# EAGLE schematic Keyboard _Schematic (EAGLE 9.7.0)

## Sheet 1 of 4
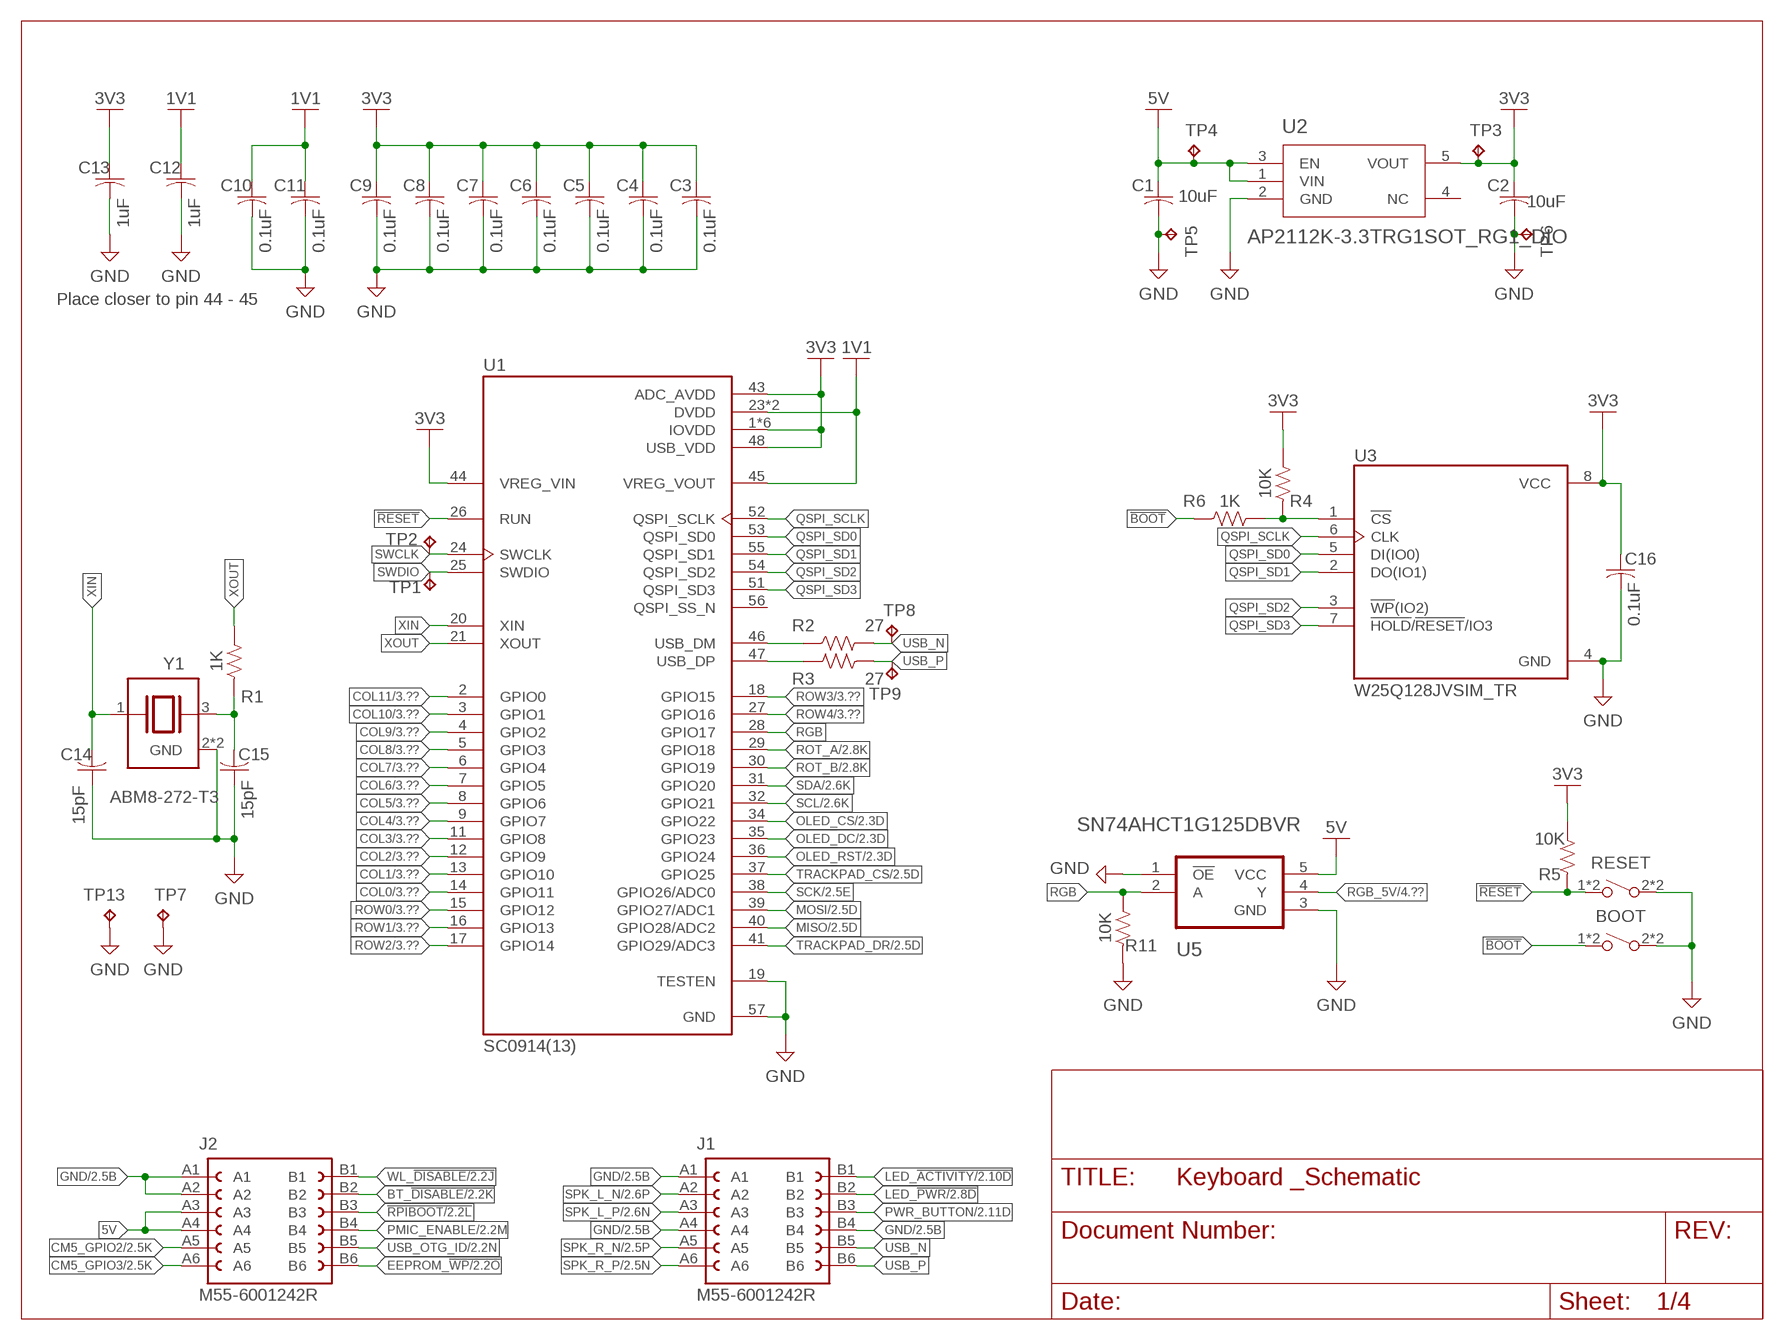
[diagram p0: schematic, sheet 1]

### Parts
BOOT  SPST-NO_SWITCH_KMR2  [KMR2]
C1  10uF  C-US_CHIP-1206(3216-METRIC)  [CAPC3216X135]
C2  10uF  C-US_CHIP-1206(3216-METRIC)  [CAPC3216X135]
C3  0.1uF  C-US_CHIP-0805(2012-METRIC)  [CAPC2012X110]
C4  0.1uF  C-US_CHIP-0805(2012-METRIC)  [CAPC2012X110]
C5  0.1uF  C-US_CHIP-0805(2012-METRIC)  [CAPC2012X110]
C6  0.1uF  C-US_CHIP-0805(2012-METRIC)  [CAPC2012X110]
C7  0.1uF  C-US_CHIP-0805(2012-METRIC)  [CAPC2012X110]
C8  0.1uF  C-US_CHIP-0805(2012-METRIC)  [CAPC2012X110]
C9  0.1uF  C-US_CHIP-0805(2012-METRIC)  [CAPC2012X110]
C10  0.1uF  C-US_CHIP-0805(2012-METRIC)  [CAPC2012X110]
C11  0.1uF  C-US_CHIP-0805(2012-METRIC)  [CAPC2012X110]
C12  1uF  C-US_CHIP-0805(2012-METRIC)  [CAPC2012X110]
C13  1uF  C-US_CHIP-0805(2012-METRIC)  [CAPC2012X110]
C14  15pF  C-US_CHIP-0805(2012-METRIC)  [CAPC2012X110]
C15  15pF  C-US_CHIP-0805(2012-METRIC)  [CAPC2012X110]
C16  0.1uF  C-US_CHIP-0805(2012-METRIC)  [CAPC2012X110]
J1  M55-6001242R  [HARWIN_M55-6001242R]
J2  M55-6001242R  [HARWIN_M55-6001242R]
R1  1K  R-US_CHIP-0805(2012-METRIC)  [RESC2012X65]
R2  27  R-US_CHIP-0805(2012-METRIC)  [RESC2012X65]
R3  27  R-US_CHIP-0805(2012-METRIC)  [RESC2012X65]
R4  10K  R-US_CHIP-0805(2012-METRIC)  [RESC2012X65]
R5  10K  R-US_CHIP-0805(2012-METRIC)  [RESC2012X65]
R6  1K  R-US_CHIP-0805(2012-METRIC)  [RESC2012X65]
R11  10K  R-US_CHIP-0805(2012-METRIC)  [RESC2012X65]
RESET  SPST-NO_SWITCH_KMR2  [KMR2]
TP1  TPB2,54  [B2,54]
TP2  TPB2,54  [B2,54]
TP3  TPB2,54  [B2,54]
TP4  TPB1,27  [B1,27]
TP5  TPB2,54  [B2,54]
TP6  TPB1,27  [B1,27]
TP7  TPB1,27  [B1,27]
TP8  TPB1,27  [B1,27]
TP9  TPB1,27  [B1,27]
TP13  TPB2,54  [B2,54]
U1  SC0914(13)  [QFN40P700X700X90-57N]
U2  AP2112K-3.3TRG1SOT_RG1_DIO  [SOT_RG1_DIO]
U3  W25Q128JVSIM_TR  [SOIC127P790X216-8N]
U5  SN74AHCT1G125DBVR  [SOT95P280X145-5N]
Y1  ABM8-272-T3  [XTAL_ABM8-272-T3]

### Nets
1V1: C10.1 C11.1 C12.1 U1.23(DVDD) U1.45(VREG_VOUT) U1.50(DVDD)
3V3: C2.1 C3.1 C4.1 C5.1 C6.1 C7.1 C8.1 C9.1 C13.1 C16.1 R4.2 R5.2 TP3.TP U1.1(IOVDD) U1.10(IOVDD) U1.22(IOVDD) U1.33(IOVDD) U1.42(IOVDD) U1.43(ADC_AVDD) U1.44(VREG_VIN) U1.48(USB_VDD) U1.49(IOVDD) U2.5(VOUT) U3.8(VCC) ; also sheet 2
5V: C1.1 J2.A3 J2.A4 TP4.TP U2.1(VIN) U2.3(EN) U5.5(VCC) ; also sheet 2,4
!BOOT: BOOT.1 BOOT.4 R6.1
!RESET: R5.1 RESET.1 RESET.4 U1.26(RUN)
!RPIBOOT: J2.B3 ; also sheet 2
BT_!DISABLE: J2.B2 ; also sheet 2
CM5_GPIO2: J2.A5 ; also sheet 2
CM5_GPIO3: J2.A6 ; also sheet 2
COL0: U1.14(GPIO11) ; also sheet 3
COL1: U1.13(GPIO10) ; also sheet 3
COL2: U1.12(GPIO9) ; also sheet 3
COL3: U1.11(GPIO8) ; also sheet 3
COL4: U1.9(GPIO7) ; also sheet 3
COL5: U1.8(GPIO6) ; also sheet 3
COL6: U1.7(GPIO5) ; also sheet 3
COL7: U1.6(GPIO4) ; also sheet 3
COL8: U1.5(GPIO3) ; also sheet 3
COL9: U1.4(GPIO2) ; also sheet 3
COL10: U1.3(GPIO1) ; also sheet 3
COL11: U1.2(GPIO0) ; also sheet 3
EEPROM_!WP: J2.B6 ; also sheet 2
GND: BOOT.2 BOOT.3 C1.2 C2.2 C3.2 C4.2 C5.2 C6.2 C7.2 C8.2 C9.2 C10.2 C11.2 C12.2 C13.2 C14.1 C15.1 C16.2 J1.A1 J1.A4 J1.B4 J2.A1 J2.A2 R11.1 RESET.2 RESET.3 TP5.TP TP6.TP TP7.TP TP13.TP U1.19(TESTEN) U1.57(GND) U2.2(GND) U3.4(GND) U5.1(!OE) U5.3(GND) Y1.2(GND) Y1.4(GND) ; also sheet 2,4
LED_!ACTIVITY: J1.B1 ; also sheet 2
LED_!PWR: J1.B2 ; also sheet 2
MISO: U1.40(GPIO28/ADC2) ; also sheet 2
MOSI: U1.39(GPIO27/ADC1) ; also sheet 2
N$2: C15.2 R1.1 Y1.3
N$12: R4.1 R6.2 U3.1(!CS)
OLED_CS: U1.34(GPIO22) ; also sheet 2
OLED_DC: U1.35(GPIO23) ; also sheet 2
OLED_RST: U1.36(GPIO24) ; also sheet 2
PMIC_ENABLE: J2.B4 ; also sheet 2
PWR_BUTTON: J1.B3 ; also sheet 2
QSPI_SCLK: U1.52(QSPI_SCLK) U3.6(CLK)
QSPI_SD0: U1.53(QSPI_SD0) U3.5(DI(IO0))
QSPI_SD1: U1.55(QSPI_SD1) U3.2(DO(IO1))
QSPI_SD2: U1.54(QSPI_SD2) U3.3(!WP!(IO2))
QSPI_SD3: U1.51(QSPI_SD3) U3.7(!HOLD!/!RESET!/IO3)
RGB: R11.2 U1.28(GPIO17) U5.2(A)
RGB_5V: U5.4(Y) ; also sheet 4
ROT_A: U1.29(GPIO18) ; also sheet 2
ROT_B: U1.30(GPIO19) ; also sheet 2
ROW0: U1.15(GPIO12) ; also sheet 3
ROW1: U1.16(GPIO13) ; also sheet 3
ROW2: U1.17(GPIO14) ; also sheet 3
ROW3: U1.18(GPIO15) ; also sheet 3
ROW4: U1.27(GPIO16) ; also sheet 3
SCK: U1.38(GPIO26/ADC0) ; also sheet 2
SCL: U1.32(GPIO21) ; also sheet 2
SDA: U1.31(GPIO20) ; also sheet 2
SPK_L_N [Audio]: J1.A2 ; also sheet 2
SPK_L_P [Audio]: J1.A3 ; also sheet 2
SPK_R_N [Audio]: J1.A5 ; also sheet 2
SPK_R_P [Audio]: J1.A6 ; also sheet 2
SWCLK: TP2.TP U1.24(SWCLK)
SWDIO: TP1.TP U1.25(SWDIO)
TRACKPAD_CS: U1.37(GPIO25) ; also sheet 2
TRACKPAD_DR: U1.41(GPIO29/ADC3) ; also sheet 2
USB_D_N: R2.1 U1.46(USB_DM)
USB_D_P: R3.2 U1.47(USB_DP)
USB_N [90 ohm]: J1.B5 R2.2 TP8.TP
USB_OTG_ID: J2.B5 ; also sheet 2
USB_P [90 ohm]: J1.B6 R3.1 TP9.TP
WL_!DISABLE: J2.B1 ; also sheet 2
XIN: C14.2 U1.20(XIN) Y1.1
XOUT: R1.2 U1.21(XOUT)
Unconnected: U1.56(QSPI_SS_N) U2.4(NC)

### Notes on the sheet
- Place closer to pin 44 - 45

## Sheet 2 of 4
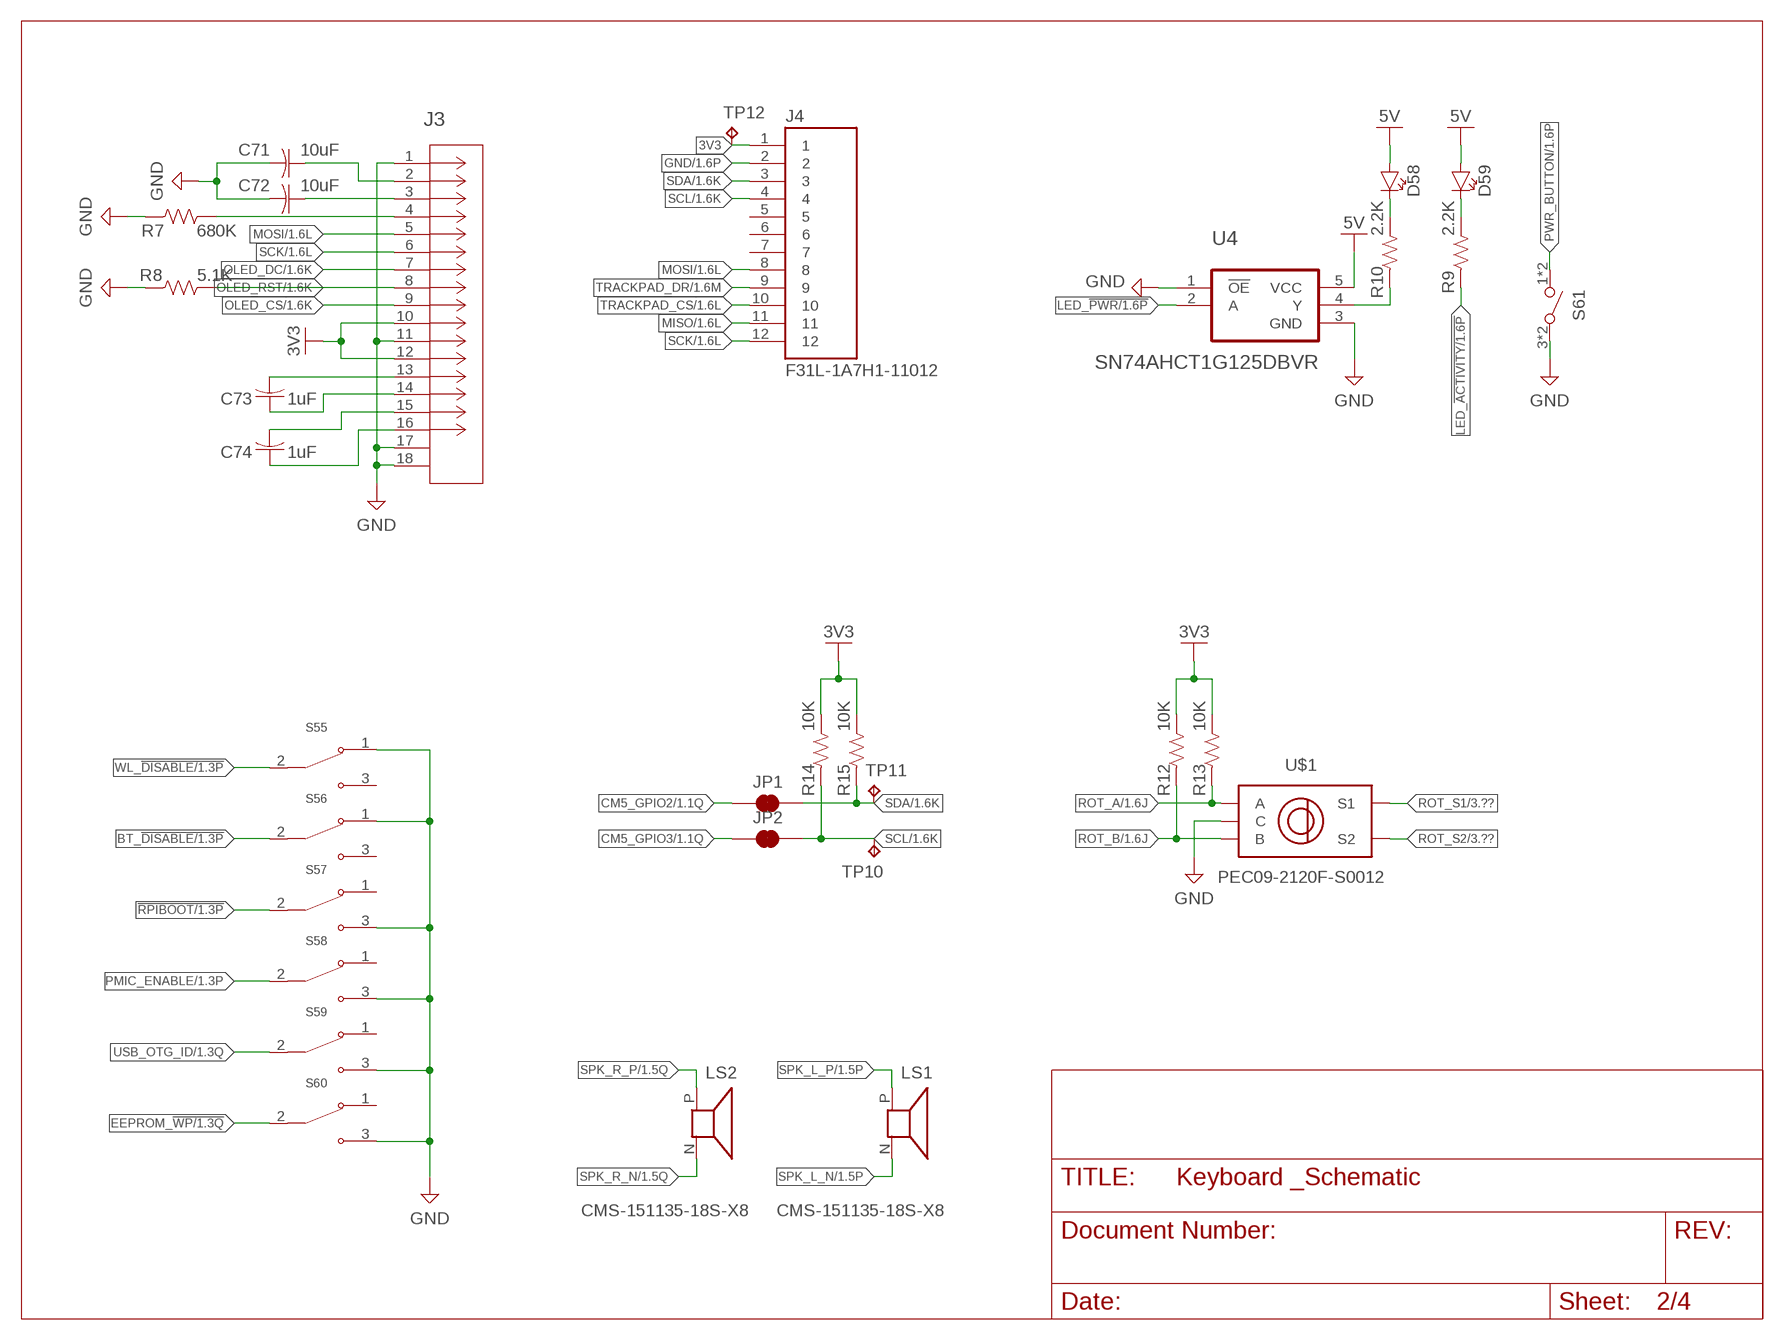
[diagram p1: schematic, sheet 2]

### Parts
C71  10uF  C-US_CHIP-1206(3216-METRIC)  [CAPC3216X135]
C72  10uF  C-US_CHIP-1206(3216-METRIC)  [CAPC3216X135]
C73  1uF  C-US_CHIP-0805(2012-METRIC)  [CAPC2012X110]
C74  1uF  C-US_CHIP-0805(2012-METRIC)  [CAPC2012X110]
D58  CHIP-FLAT-G_1206  [LEDC3216X75N_FLAT-G]
D59  CHIP-FLAT-G_1206  [LEDC3216X75N_FLAT-G]
J3  1-1775333-6CONN16_1-1775333-6_TEC  [CONN16_1-1775333-6_TEC]
J4  F31L-1A7H1-11012  [AMPHENOL_F31L-1A7H1-11012]
JP1  JUMPER-SMT_2_NC_TRACE_NO-SILK  [SMT-JUMPER_2_NC_TRACE_NO-SILK]
JP2  JUMPER-SMT_2_NC_TRACE_NO-SILK  [SMT-JUMPER_2_NC_TRACE_NO-SILK]
LS1  CMS-151135-18S-X8  [SPKR_CMS-151135-18S-X8]
LS2  CMS-151135-18S-X8  [SPKR_CMS-151135-18S-X8]
R7  680K  R-US_CHIP-0805(2012-METRIC)  [RESC2012X65]
R8  5.1K  R-US_CHIP-0805(2012-METRIC)  [RESC2012X65]
R9  2.2K  R-US_CHIP-0805(2012-METRIC)  [RESC2012X65]
R10  2.2K  R-US_CHIP-0805(2012-METRIC)  [RESC2012X65]
R12  10K  R-US_CHIP-0805(2012-METRIC)  [RESC2012X65]
R13  10K  R-US_CHIP-0805(2012-METRIC)  [RESC2012X65]
R14  10K  R-US_CHIP-0805(2012-METRIC)  [RESC2012X65]
R15  10K  R-US_CHIP-0805(2012-METRIC)  [RESC2012X65]
S55  SLW-1277744-3A-N-D  [SW_SLW-1277744-3A-N-D]
S56  SLW-1277744-3A-N-D  [SW_SLW-1277744-3A-N-D]
S57  SLW-1277744-3A-N-D  [SW_SLW-1277744-3A-N-D]
S58  SLW-1277744-3A-N-D  [SW_SLW-1277744-3A-N-D]
S59  SLW-1277744-3A-N-D  [SW_SLW-1277744-3A-N-D]
S60  SLW-1277744-3A-N-D  [SW_SLW-1277744-3A-N-D]
S61  SPST-NO_SWITCH_PTS645-SMT-6MM  [PTS645-SMT-6MM]
TP10  TPB1,27  [B1,27]
TP11  TPB1,27  [B1,27]
TP12  TPB1,27  [B1,27]
U4  SN74AHCT1G125DBVR  [SOT95P280X145-5N]
U$1  PEC09-2120F-S0012  [PEC09-2XXXF-SXXXX]

### Nets
3V3: J3.10 J3.12 J4.1 R12.2 R13.2 R14.2 R15.2 TP12.TP ; also sheet 1
5V: D58.A D59.A U4.5(VCC) ; also sheet 1,4
!RPIBOOT: S57.2 ; also sheet 1
BT_!DISABLE: S56.2 ; also sheet 1
CM5_GPIO2: JP1.1 ; also sheet 1
CM5_GPIO3: JP2.1 ; also sheet 1
EEPROM_!WP: S60.2 ; also sheet 1
GND: C71.2 C72.2 J3.1 J3.11 J3.17 J3.18 J4.2 R7.1 R8.1 S55.1 S56.1 S57.3 S58.3 S59.3 S60.3 S61.3 S61.4 U4.1(!OE) U4.3(GND) U$1.P$2(C) ; also sheet 1,4
LED_!ACTIVITY: R9.1 ; also sheet 1
LED_!PWR: U4.2(A) ; also sheet 1
MISO: J4.11 ; also sheet 1
MOSI: J3.5 J4.8 ; also sheet 1
N$3: D59.C R9.2
N$60: C71.1 J3.2
N$61: C72.1 J3.3
N$63: J3.4 R7.2
N$64: C73.2 J3.13
N$66: C73.1 J3.14
N$69: C74.2 J3.15
N$70: C74.1 J3.16
N$71: D58.C R10.2
N$72: R10.1 U4.4(Y)
OLED_CS: J3.9 ; also sheet 1
OLED_DC: J3.7 ; also sheet 1
OLED_RST: J3.8 R8.2 ; also sheet 1
PMIC_ENABLE: S58.2 ; also sheet 1
PWR_BUTTON: S61.1 S61.2 ; also sheet 1
ROT_A: R13.1 U$1.P$3(A) ; also sheet 1
ROT_B: R12.1 U$1.P$1(B) ; also sheet 1
ROT_S1: U$1.P$4(S1) ; also sheet 3
ROT_S2: U$1.P$5(S2) ; also sheet 3
SCK: J3.6 J4.12 ; also sheet 1
SCL: J4.4 JP2.2 R14.1 TP10.TP ; also sheet 1
SDA: J4.3 JP1.2 R15.1 TP11.TP ; also sheet 1
SPK_L_N [Audio]: LS1.N ; also sheet 1
SPK_L_P [Audio]: LS1.P ; also sheet 1
SPK_R_N [Audio]: LS2.N ; also sheet 1
SPK_R_P [Audio]: LS2.P ; also sheet 1
TRACKPAD_CS: J4.10 ; also sheet 1
TRACKPAD_DR: J4.9 ; also sheet 1
USB_OTG_ID: S59.2 ; also sheet 1
WL_!DISABLE: S55.2 ; also sheet 1
Unconnected: J4.5 J4.6 J4.7 S55.3 S56.3 S57.1 S58.1 S59.1 S60.1

## Sheet 3 of 4
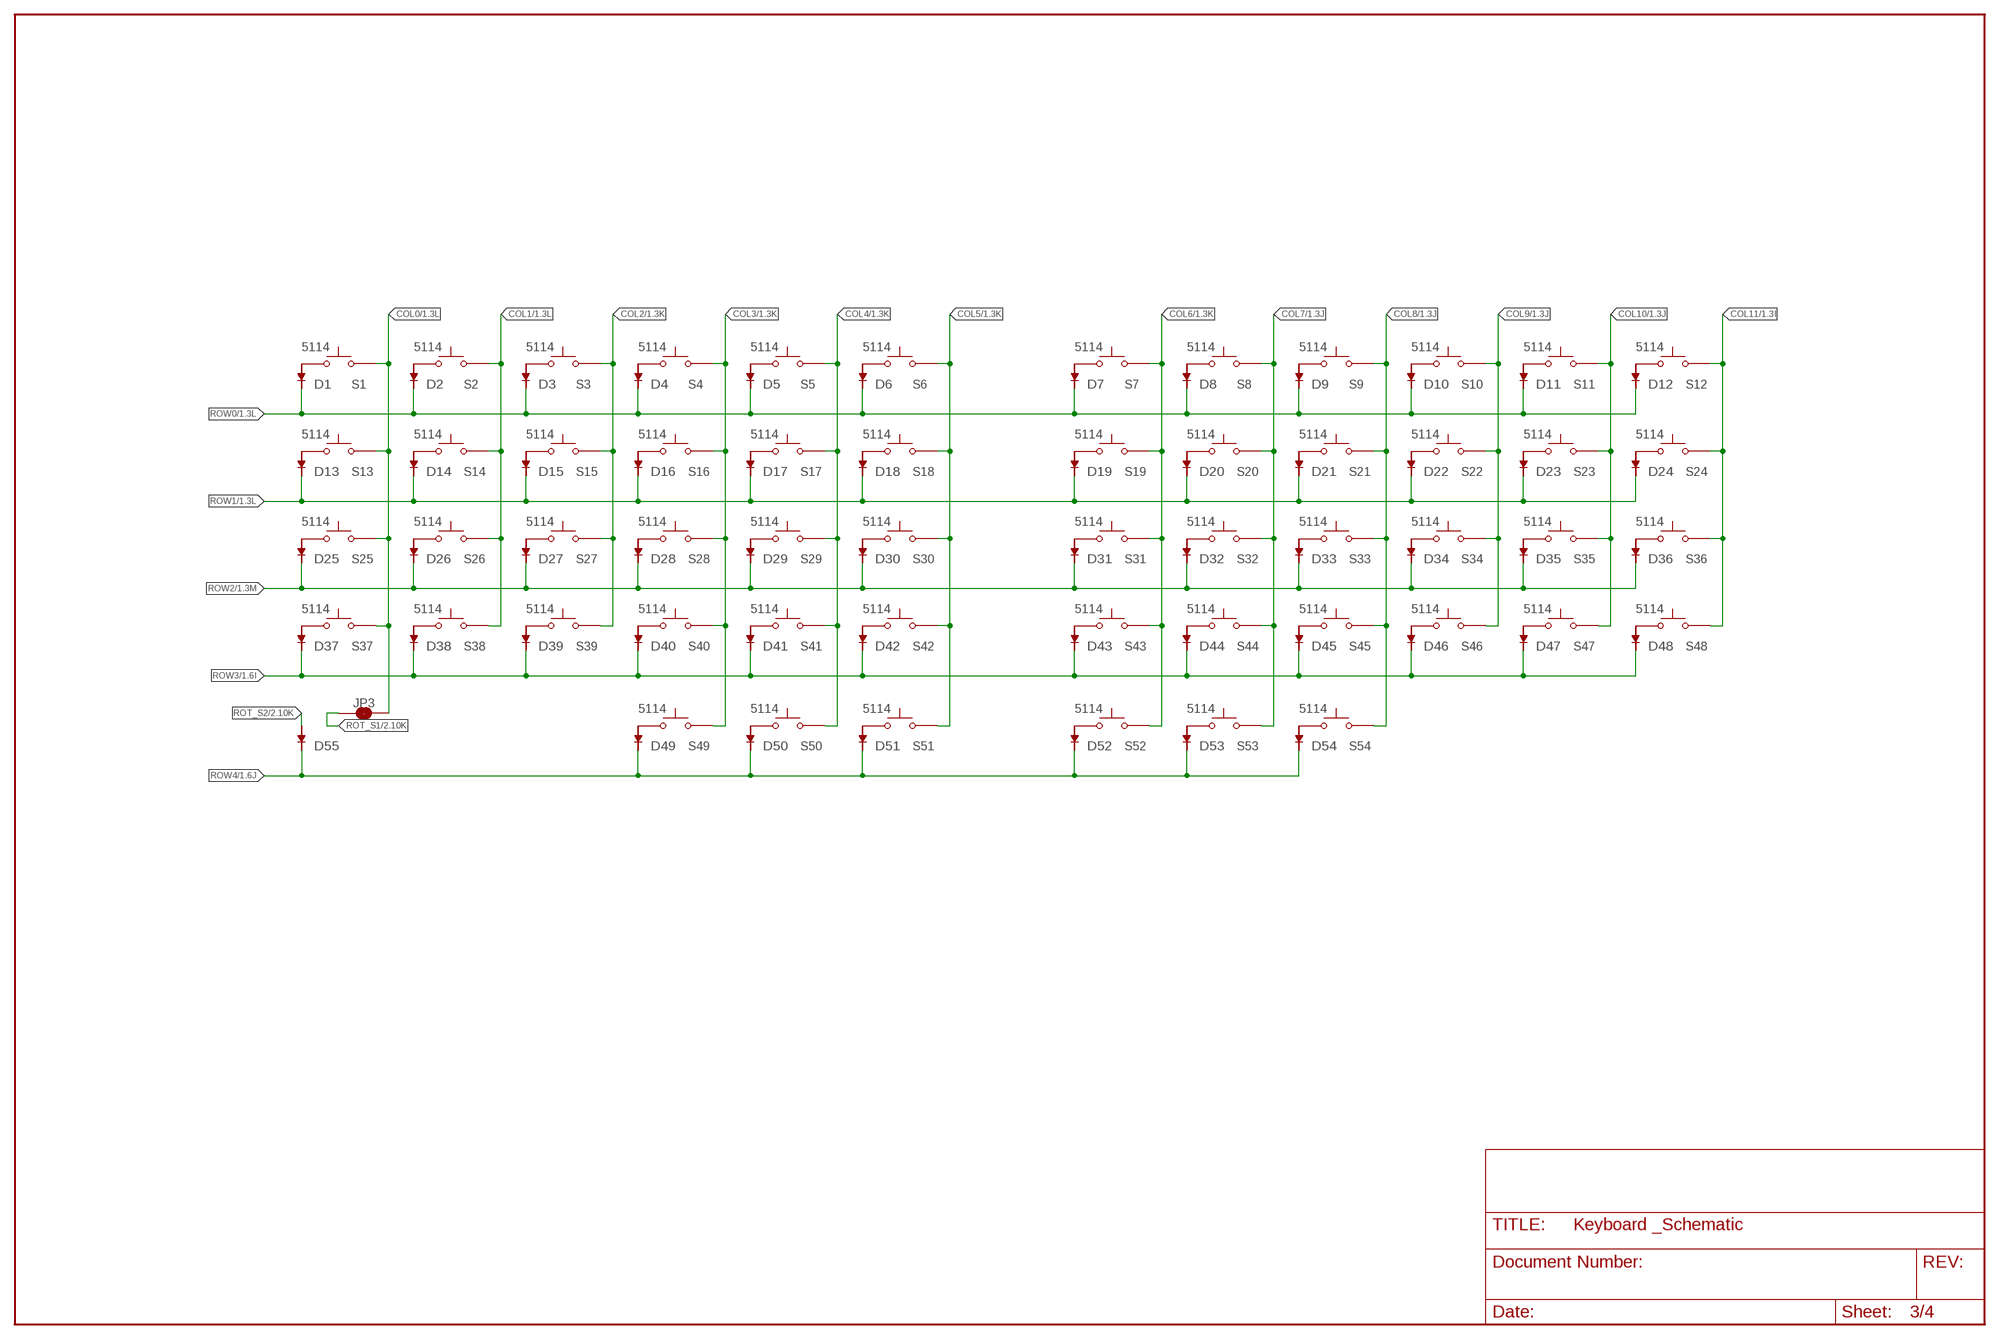
[diagram p2: schematic, sheet 3]

### Parts
D1  1N4148W  [SOD3715X135N]
D2  1N4148W  [SOD3715X135N]
D3  1N4148W  [SOD3715X135N]
D4  1N4148W  [SOD3715X135N]
D5  1N4148W  [SOD3715X135N]
D6  1N4148W  [SOD3715X135N]
D7  1N4148W  [SOD3715X135N]
D8  1N4148W  [SOD3715X135N]
D9  1N4148W  [SOD3715X135N]
D10  1N4148W  [SOD3715X135N]
D11  1N4148W  [SOD3715X135N]
D12  1N4148W  [SOD3715X135N]
D13  1N4148W  [SOD3715X135N]
D14  1N4148W  [SOD3715X135N]
D15  1N4148W  [SOD3715X135N]
D16  1N4148W  [SOD3715X135N]
D17  1N4148W  [SOD3715X135N]
D18  1N4148W  [SOD3715X135N]
D19  1N4148W  [SOD3715X135N]
D20  1N4148W  [SOD3715X135N]
D21  1N4148W  [SOD3715X135N]
D22  1N4148W  [SOD3715X135N]
D23  1N4148W  [SOD3715X135N]
D24  1N4148W  [SOD3715X135N]
D25  1N4148W  [SOD3715X135N]
D26  1N4148W  [SOD3715X135N]
D27  1N4148W  [SOD3715X135N]
D28  1N4148W  [SOD3715X135N]
D29  1N4148W  [SOD3715X135N]
D30  1N4148W  [SOD3715X135N]
D31  1N4148W  [SOD3715X135N]
D32  1N4148W  [SOD3715X135N]
D33  1N4148W  [SOD3715X135N]
D34  1N4148W  [SOD3715X135N]
D35  1N4148W  [SOD3715X135N]
D36  1N4148W  [SOD3715X135N]
D37  1N4148W  [SOD3715X135N]
D38  1N4148W  [SOD3715X135N]
D39  1N4148W  [SOD3715X135N]
D40  1N4148W  [SOD3715X135N]
D41  1N4148W  [SOD3715X135N]
D42  1N4148W  [SOD3715X135N]
D43  1N4148W  [SOD3715X135N]
D44  1N4148W  [SOD3715X135N]
D45  1N4148W  [SOD3715X135N]
D46  1N4148W  [SOD3715X135N]
D47  1N4148W  [SOD3715X135N]
D48  1N4148W  [SOD3715X135N]
D49  1N4148W  [SOD3715X135N]
D50  1N4148W  [SOD3715X135N]
D51  1N4148W  [SOD3715X135N]
D52  1N4148W  [SOD3715X135N]
D53  1N4148W  [SOD3715X135N]
D54  1N4148W  [SOD3715X135N]
D55  1N4148W  [SOD3715X135N]
JP3  JUMPER-SMT_2_NC_TRACE_NO-SILK  [SMT-JUMPER_2_NC_TRACE_NO-SILK]
S1  5114  [SW_5114]
S2  5114  [SW_5114]
S3  5114  [SW_5114]
S4  5114  [SW_5114]
S5  5114  [SW_5114]
S6  5114  [SW_5114]
S7  5114  [SW_5114]
S8  5114  [SW_5114]
S9  5114  [SW_5114]
S10  5114  [SW_5114]
S11  5114  [SW_5114]
S12  5114  [SW_5114]
S13  5114  [SW_5114]
S14  5114  [SW_5114]
S15  5114  [SW_5114]
S16  5114  [SW_5114]
S17  5114  [SW_5114]
S18  5114  [SW_5114]
S19  5114  [SW_5114]
S20  5114  [SW_5114]
S21  5114  [SW_5114]
S22  5114  [SW_5114]
S23  5114  [SW_5114]
S24  5114  [SW_5114]
S25  5114  [SW_5114]
S26  5114  [SW_5114]
S27  5114  [SW_5114]
S28  5114  [SW_5114]
S29  5114  [SW_5114]
S30  5114  [SW_5114]
S31  5114  [SW_5114]
S32  5114  [SW_5114]
S33  5114  [SW_5114]
S34  5114  [SW_5114]
S35  5114  [SW_5114]
S36  5114  [SW_5114]
S37  5114  [SW_5114]
S38  5114  [SW_5114]
S39  5114  [SW_5114]
S40  5114  [SW_5114]
S41  5114  [SW_5114]
S42  5114  [SW_5114]
S43  5114  [SW_5114]
S44  5114  [SW_5114]
S45  5114  [SW_5114]
S46  5114  [SW_5114]
S47  5114  [SW_5114]
S48  5114  [SW_5114]
S49  5114  [SW_5114]
S50  5114  [SW_5114]
S51  5114  [SW_5114]
S52  5114  [SW_5114]
S53  5114  [SW_5114]
S54  5114  [SW_5114]

### Nets
COL0: JP3.1 S1.P$2 S13.P$2 S25.P$2 S37.P$2 ; also sheet 1
COL1: S2.P$2 S14.P$2 S26.P$2 S38.P$2 ; also sheet 1
COL2: S3.P$2 S15.P$2 S27.P$2 S39.P$2 ; also sheet 1
COL3: S4.P$2 S16.P$2 S28.P$2 S40.P$2 S49.P$2 ; also sheet 1
COL4: S5.P$2 S17.P$2 S29.P$2 S41.P$2 S50.P$2 ; also sheet 1
COL5: S6.P$2 S18.P$2 S30.P$2 S42.P$2 S51.P$2 ; also sheet 1
COL6: S7.P$2 S19.P$2 S31.P$2 S43.P$2 S52.P$2 ; also sheet 1
COL7: S8.P$2 S20.P$2 S32.P$2 S44.P$2 S53.P$2 ; also sheet 1
COL8: S9.P$2 S21.P$2 S33.P$2 S45.P$2 S54.P$2 ; also sheet 1
COL9: S10.P$2 S22.P$2 S34.P$2 S46.P$2 ; also sheet 1
COL10: S11.P$2 S23.P$2 S35.P$2 S47.P$2 ; also sheet 1
COL11: S12.P$2 S24.P$2 S36.P$2 S48.P$2 ; also sheet 1
N$1: D1.A S1.P$1
N$6: D2.A S2.P$1
N$7: D3.A S3.P$1
N$8: D4.A S4.P$1
N$9: D5.A S5.P$1
N$10: D6.A S6.P$1
N$11: D7.A S7.P$1
N$13: D8.A S8.P$1
N$14: D9.A S9.P$1
N$15: D10.A S10.P$1
N$16: D11.A S11.P$1
N$17: D12.A S12.P$1
N$18: D13.A S13.P$1
N$19: D14.A S14.P$1
N$20: D15.A S15.P$1
N$21: D16.A S16.P$1
N$22: D17.A S17.P$1
N$23: D18.A S18.P$1
N$24: D19.A S19.P$1
N$25: D20.A S20.P$1
N$26: D21.A S21.P$1
N$27: D22.A S22.P$1
N$28: D23.A S23.P$1
N$29: D24.A S24.P$1
N$30: D25.A S25.P$1
N$31: D26.A S26.P$1
N$32: D27.A S27.P$1
N$33: D28.A S28.P$1
N$34: D29.A S29.P$1
N$35: D30.A S30.P$1
N$36: D31.A S31.P$1
N$37: D32.A S32.P$1
N$38: D33.A S33.P$1
N$39: D34.A S34.P$1
N$40: D35.A S35.P$1
N$41: D36.A S36.P$1
N$42: D37.A S37.P$1
N$43: D38.A S38.P$1
N$44: D39.A S39.P$1
N$45: D40.A S40.P$1
N$46: D41.A S41.P$1
N$47: D42.A S42.P$1
N$48: D43.A S43.P$1
N$49: D44.A S44.P$1
N$50: D45.A S45.P$1
N$51: D46.A S46.P$1
N$52: D47.A S47.P$1
N$53: D48.A S48.P$1
N$54: D49.A S49.P$1
N$55: D50.A S50.P$1
N$56: D51.A S51.P$1
N$57: D52.A S52.P$1
N$58: D53.A S53.P$1
N$59: D54.A S54.P$1
ROT_S1: JP3.2 ; also sheet 2
ROT_S2: D55.A ; also sheet 2
ROW0: D1.C(K) D2.C(K) D3.C(K) D4.C(K) D5.C(K) D6.C(K) D7.C(K) D8.C(K) D9.C(K) D10.C(K) D11.C(K) D12.C(K) ; also sheet 1
ROW1: D13.C(K) D14.C(K) D15.C(K) D16.C(K) D17.C(K) D18.C(K) D19.C(K) D20.C(K) D21.C(K) D22.C(K) D23.C(K) D24.C(K) ; also sheet 1
ROW2: D25.C(K) D26.C(K) D27.C(K) D28.C(K) D29.C(K) D30.C(K) D31.C(K) D32.C(K) D33.C(K) D34.C(K) D35.C(K) D36.C(K) ; also sheet 1
ROW3: D37.C(K) D38.C(K) D39.C(K) D40.C(K) D41.C(K) D42.C(K) D43.C(K) D44.C(K) D45.C(K) D46.C(K) D47.C(K) D48.C(K) ; also sheet 1
ROW4: D49.C(K) D50.C(K) D51.C(K) D52.C(K) D53.C(K) D54.C(K) D55.C(K) ; also sheet 1

## Sheet 4 of 4
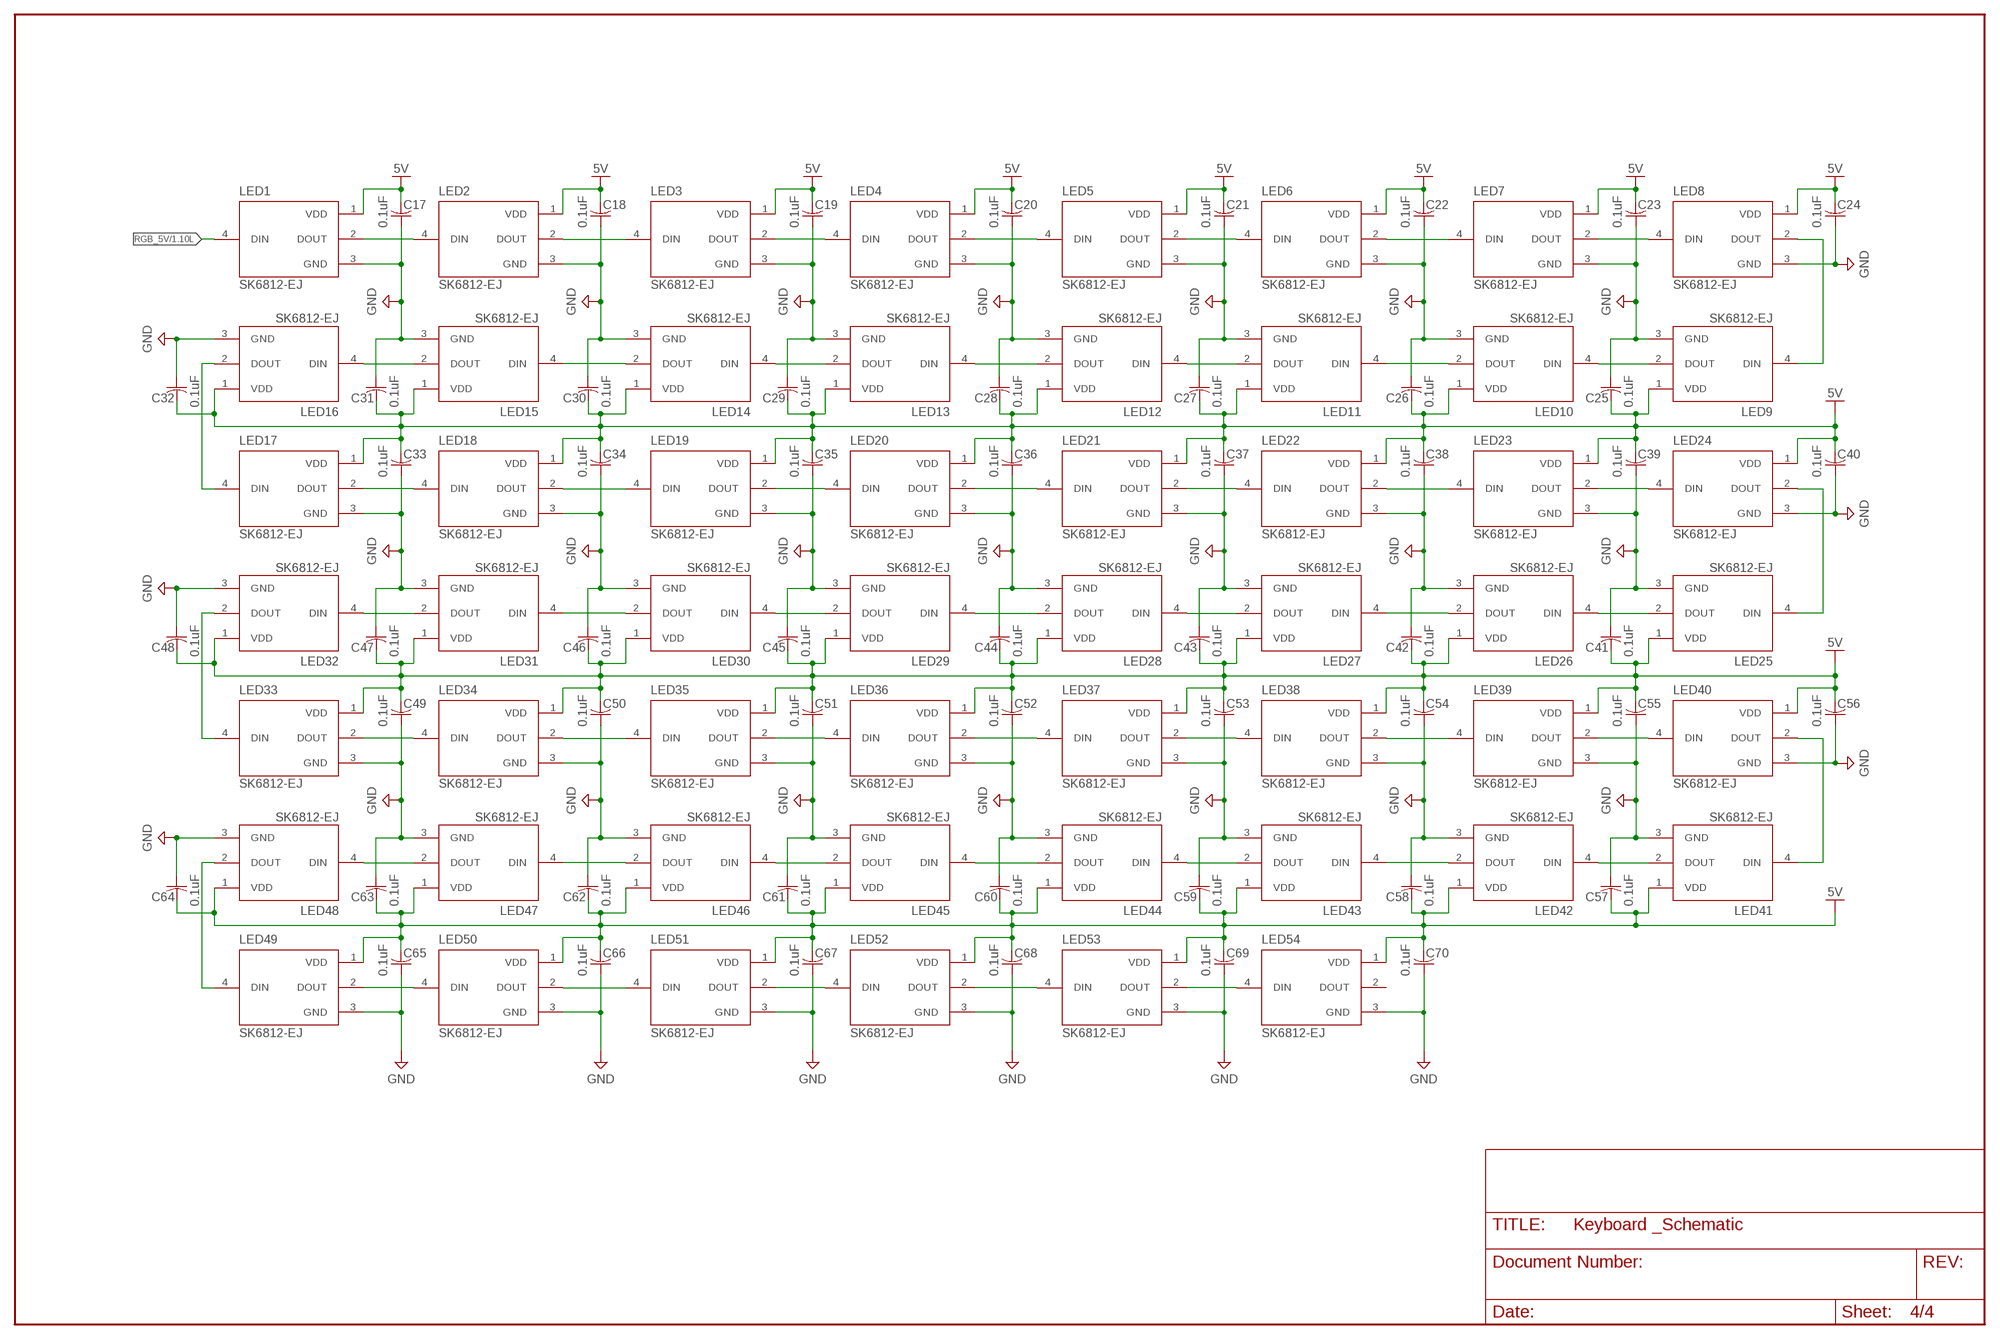
[diagram p3: schematic, sheet 4]

### Parts
C17  0.1uF  C-US_CHIP-0805(2012-METRIC)  [CAPC2012X110]
C18  0.1uF  C-US_CHIP-0805(2012-METRIC)  [CAPC2012X110]
C19  0.1uF  C-US_CHIP-0805(2012-METRIC)  [CAPC2012X110]
C20  0.1uF  C-US_CHIP-0805(2012-METRIC)  [CAPC2012X110]
C21  0.1uF  C-US_CHIP-0805(2012-METRIC)  [CAPC2012X110]
C22  0.1uF  C-US_CHIP-0805(2012-METRIC)  [CAPC2012X110]
C23  0.1uF  C-US_CHIP-0805(2012-METRIC)  [CAPC2012X110]
C24  0.1uF  C-US_CHIP-0805(2012-METRIC)  [CAPC2012X110]
C25  0.1uF  C-US_CHIP-0805(2012-METRIC)  [CAPC2012X110]
C26  0.1uF  C-US_CHIP-0805(2012-METRIC)  [CAPC2012X110]
C27  0.1uF  C-US_CHIP-0805(2012-METRIC)  [CAPC2012X110]
C28  0.1uF  C-US_CHIP-0805(2012-METRIC)  [CAPC2012X110]
C29  0.1uF  C-US_CHIP-0805(2012-METRIC)  [CAPC2012X110]
C30  0.1uF  C-US_CHIP-0805(2012-METRIC)  [CAPC2012X110]
C31  0.1uF  C-US_CHIP-0805(2012-METRIC)  [CAPC2012X110]
C32  0.1uF  C-US_CHIP-0805(2012-METRIC)  [CAPC2012X110]
C33  0.1uF  C-US_CHIP-0805(2012-METRIC)  [CAPC2012X110]
C34  0.1uF  C-US_CHIP-0805(2012-METRIC)  [CAPC2012X110]
C35  0.1uF  C-US_CHIP-0805(2012-METRIC)  [CAPC2012X110]
C36  0.1uF  C-US_CHIP-0805(2012-METRIC)  [CAPC2012X110]
C37  0.1uF  C-US_CHIP-0805(2012-METRIC)  [CAPC2012X110]
C38  0.1uF  C-US_CHIP-0805(2012-METRIC)  [CAPC2012X110]
C39  0.1uF  C-US_CHIP-0805(2012-METRIC)  [CAPC2012X110]
C40  0.1uF  C-US_CHIP-0805(2012-METRIC)  [CAPC2012X110]
C41  0.1uF  C-US_CHIP-0805(2012-METRIC)  [CAPC2012X110]
C42  0.1uF  C-US_CHIP-0805(2012-METRIC)  [CAPC2012X110]
C43  0.1uF  C-US_CHIP-0805(2012-METRIC)  [CAPC2012X110]
C44  0.1uF  C-US_CHIP-0805(2012-METRIC)  [CAPC2012X110]
C45  0.1uF  C-US_CHIP-0805(2012-METRIC)  [CAPC2012X110]
C46  0.1uF  C-US_CHIP-0805(2012-METRIC)  [CAPC2012X110]
C47  0.1uF  C-US_CHIP-0805(2012-METRIC)  [CAPC2012X110]
C48  0.1uF  C-US_CHIP-0805(2012-METRIC)  [CAPC2012X110]
C49  0.1uF  C-US_CHIP-0805(2012-METRIC)  [CAPC2012X110]
C50  0.1uF  C-US_CHIP-0805(2012-METRIC)  [CAPC2012X110]
C51  0.1uF  C-US_CHIP-0805(2012-METRIC)  [CAPC2012X110]
C52  0.1uF  C-US_CHIP-0805(2012-METRIC)  [CAPC2012X110]
C53  0.1uF  C-US_CHIP-0805(2012-METRIC)  [CAPC2012X110]
C54  0.1uF  C-US_CHIP-0805(2012-METRIC)  [CAPC2012X110]
C55  0.1uF  C-US_CHIP-0805(2012-METRIC)  [CAPC2012X110]
C56  0.1uF  C-US_CHIP-0805(2012-METRIC)  [CAPC2012X110]
C57  0.1uF  C-US_CHIP-0805(2012-METRIC)  [CAPC2012X110]
C58  0.1uF  C-US_CHIP-0805(2012-METRIC)  [CAPC2012X110]
C59  0.1uF  C-US_CHIP-0805(2012-METRIC)  [CAPC2012X110]
C60  0.1uF  C-US_CHIP-0805(2012-METRIC)  [CAPC2012X110]
C61  0.1uF  C-US_CHIP-0805(2012-METRIC)  [CAPC2012X110]
C62  0.1uF  C-US_CHIP-0805(2012-METRIC)  [CAPC2012X110]
C63  0.1uF  C-US_CHIP-0805(2012-METRIC)  [CAPC2012X110]
C64  0.1uF  C-US_CHIP-0805(2012-METRIC)  [CAPC2012X110]
C65  0.1uF  C-US_CHIP-0805(2012-METRIC)  [CAPC2012X110]
C66  0.1uF  C-US_CHIP-0805(2012-METRIC)  [CAPC2012X110]
C67  0.1uF  C-US_CHIP-0805(2012-METRIC)  [CAPC2012X110]
C68  0.1uF  C-US_CHIP-0805(2012-METRIC)  [CAPC2012X110]
C69  0.1uF  C-US_CHIP-0805(2012-METRIC)  [CAPC2012X110]
C70  0.1uF  C-US_CHIP-0805(2012-METRIC)  [CAPC2012X110]
LED1  SK6812-EJ  [LED_SK6812-E]
LED2  SK6812-EJ  [LED_SK6812-E]
LED3  SK6812-EJ  [LED_SK6812-E]
LED4  SK6812-EJ  [LED_SK6812-E]
LED5  SK6812-EJ  [LED_SK6812-E]
LED6  SK6812-EJ  [LED_SK6812-E]
LED7  SK6812-EJ  [LED_SK6812-E]
LED8  SK6812-EJ  [LED_SK6812-E]
LED9  SK6812-EJ  [LED_SK6812-E]
LED10  SK6812-EJ  [LED_SK6812-E]
LED11  SK6812-EJ  [LED_SK6812-E]
LED12  SK6812-EJ  [LED_SK6812-E]
LED13  SK6812-EJ  [LED_SK6812-E]
LED14  SK6812-EJ  [LED_SK6812-E]
LED15  SK6812-EJ  [LED_SK6812-E]
LED16  SK6812-EJ  [LED_SK6812-E]
LED17  SK6812-EJ  [LED_SK6812-E]
LED18  SK6812-EJ  [LED_SK6812-E]
LED19  SK6812-EJ  [LED_SK6812-E]
LED20  SK6812-EJ  [LED_SK6812-E]
LED21  SK6812-EJ  [LED_SK6812-E]
LED22  SK6812-EJ  [LED_SK6812-E]
LED23  SK6812-EJ  [LED_SK6812-E]
LED24  SK6812-EJ  [LED_SK6812-E]
LED25  SK6812-EJ  [LED_SK6812-E]
LED26  SK6812-EJ  [LED_SK6812-E]
LED27  SK6812-EJ  [LED_SK6812-E]
LED28  SK6812-EJ  [LED_SK6812-E]
LED29  SK6812-EJ  [LED_SK6812-E]
LED30  SK6812-EJ  [LED_SK6812-E]
LED31  SK6812-EJ  [LED_SK6812-E]
LED32  SK6812-EJ  [LED_SK6812-E]
LED33  SK6812-EJ  [LED_SK6812-E]
LED34  SK6812-EJ  [LED_SK6812-E]
LED35  SK6812-EJ  [LED_SK6812-E]
LED36  SK6812-EJ  [LED_SK6812-E]
LED37  SK6812-EJ  [LED_SK6812-E]
LED38  SK6812-EJ  [LED_SK6812-E]
LED39  SK6812-EJ  [LED_SK6812-E]
LED40  SK6812-EJ  [LED_SK6812-E]
LED41  SK6812-EJ  [LED_SK6812-E]
LED42  SK6812-EJ  [LED_SK6812-E]
LED43  SK6812-EJ  [LED_SK6812-E]
LED44  SK6812-EJ  [LED_SK6812-E]
LED45  SK6812-EJ  [LED_SK6812-E]
LED46  SK6812-EJ  [LED_SK6812-E]
LED47  SK6812-EJ  [LED_SK6812-E]
LED48  SK6812-EJ  [LED_SK6812-E]
LED49  SK6812-EJ  [LED_SK6812-E]
LED50  SK6812-EJ  [LED_SK6812-E]
LED51  SK6812-EJ  [LED_SK6812-E]
LED52  SK6812-EJ  [LED_SK6812-E]
LED53  SK6812-EJ  [LED_SK6812-E]
LED54  SK6812-EJ  [LED_SK6812-E]

### Nets
5V: C17.2 C18.2 C19.2 C20.2 C21.2 C22.2 C23.2 C24.2 C25.2 C26.2 C27.2 C28.2 C29.2 C30.2 C31.2 C32.2 C33.2 C34.2 C35.2 C36.2 C37.2 C38.2 C39.2 C40.2 C41.2 C42.2 C43.2 C44.2 C45.2 C46.2 C47.2 C48.2 C49.2 C50.2 C51.2 C52.2 C53.2 C54.2 C55.2 C56.2 C57.2 C58.2 C59.2 C60.2 C61.2 C62.2 C63.2 C64.2 C65.2 C66.2 C67.2 C68.2 C69.2 C70.2 LED1.1(VDD) LED2.1(VDD) LED3.1(VDD) LED4.1(VDD) LED5.1(VDD) LED6.1(VDD) LED7.1(VDD) LED8.1(VDD) LED9.1(VDD) LED10.1(VDD) LED11.1(VDD) LED12.1(VDD) LED13.1(VDD) LED14.1(VDD) LED15.1(VDD) LED16.1(VDD) LED17.1(VDD) LED18.1(VDD) LED19.1(VDD) LED20.1(VDD) LED21.1(VDD) LED22.1(VDD) LED23.1(VDD) LED24.1(VDD) LED25.1(VDD) LED26.1(VDD) LED27.1(VDD) LED28.1(VDD) LED29.1(VDD) LED30.1(VDD) LED31.1(VDD) LED32.1(VDD) LED33.1(VDD) LED34.1(VDD) LED35.1(VDD) LED36.1(VDD) LED37.1(VDD) LED38.1(VDD) LED39.1(VDD) LED40.1(VDD) LED41.1(VDD) LED42.1(VDD) LED43.1(VDD) LED44.1(VDD) LED45.1(VDD) LED46.1(VDD) LED47.1(VDD) LED48.1(VDD) LED49.1(VDD) LED50.1(VDD) LED51.1(VDD) LED52.1(VDD) LED53.1(VDD) LED54.1(VDD) ; also sheet 1,2
GND: C17.1 C18.1 C19.1 C20.1 C21.1 C22.1 C23.1 C24.1 C25.1 C26.1 C27.1 C28.1 C29.1 C30.1 C31.1 C32.1 C33.1 C34.1 C35.1 C36.1 C37.1 C38.1 C39.1 C40.1 C41.1 C42.1 C43.1 C44.1 C45.1 C46.1 C47.1 C48.1 C49.1 C50.1 C51.1 C52.1 C53.1 C54.1 C55.1 C56.1 C57.1 C58.1 C59.1 C60.1 C61.1 C62.1 C63.1 C64.1 C65.1 C66.1 C67.1 C68.1 C69.1 C70.1 LED1.3(GND) LED2.3(GND) LED3.3(GND) LED4.3(GND) LED5.3(GND) LED6.3(GND) LED7.3(GND) LED8.3(GND) LED9.3(GND) LED10.3(GND) LED11.3(GND) LED12.3(GND) LED13.3(GND) LED14.3(GND) LED15.3(GND) LED16.3(GND) LED17.3(GND) LED18.3(GND) LED19.3(GND) LED20.3(GND) LED21.3(GND) LED22.3(GND) LED23.3(GND) LED24.3(GND) LED25.3(GND) LED26.3(GND) LED27.3(GND) LED28.3(GND) LED29.3(GND) LED30.3(GND) LED31.3(GND) LED32.3(GND) LED33.3(GND) LED34.3(GND) LED35.3(GND) LED36.3(GND) LED37.3(GND) LED38.3(GND) LED39.3(GND) LED40.3(GND) LED41.3(GND) LED42.3(GND) LED43.3(GND) LED44.3(GND) LED45.3(GND) LED46.3(GND) LED47.3(GND) LED48.3(GND) LED49.3(GND) LED50.3(GND) LED51.3(GND) LED52.3(GND) LED53.3(GND) LED54.3(GND) ; also sheet 1,2
N$4: LED8.2(DOUT) LED9.4(DIN)
N$5: LED24.2(DOUT) LED25.4(DIN)
N$62: LED1.2(DOUT) LED2.4(DIN)
N$65: LED17.2(DOUT) LED18.4(DIN)
N$67: LED3.2(DOUT) LED4.4(DIN)
N$68: LED2.2(DOUT) LED3.4(DIN)
N$73: LED5.2(DOUT) LED6.4(DIN)
N$74: LED19.2(DOUT) LED20.4(DIN)
N$75: LED40.2(DOUT) LED41.4(DIN)
N$76: LED18.2(DOUT) LED19.4(DIN)
N$80: LED7.2(DOUT) LED8.4(DIN)
N$81: LED6.2(DOUT) LED7.4(DIN)
N$82: LED4.2(DOUT) LED5.4(DIN)
N$87: LED9.2(DOUT) LED10.4(DIN)
N$88: LED21.2(DOUT) LED22.4(DIN)
N$92: LED11.2(DOUT) LED12.4(DIN)
N$93: LED10.2(DOUT) LED11.4(DIN)
N$98: LED13.2(DOUT) LED14.4(DIN)
N$99: LED23.2(DOUT) LED24.4(DIN)
N$101: LED22.2(DOUT) LED23.4(DIN)
N$103: LED15.2(DOUT) LED16.4(DIN)
N$104: LED14.2(DOUT) LED15.4(DIN)
N$105: LED12.2(DOUT) LED13.4(DIN)
N$106: LED20.2(DOUT) LED21.4(DIN)
N$109: LED25.2(DOUT) LED26.4(DIN)
N$112: LED27.2(DOUT) LED28.4(DIN)
N$113: LED26.2(DOUT) LED27.4(DIN)
N$116: LED29.2(DOUT) LED30.4(DIN)
N$119: LED31.2(DOUT) LED32.4(DIN)
N$120: LED30.2(DOUT) LED31.4(DIN)
N$121: LED28.2(DOUT) LED29.4(DIN)
N$122: LED16.2(DOUT) LED17.4(DIN)
N$125: LED33.2(DOUT) LED34.4(DIN)
N$128: LED35.2(DOUT) LED36.4(DIN)
N$129: LED34.2(DOUT) LED35.4(DIN)
N$132: LED37.2(DOUT) LED38.4(DIN)
N$136: LED39.2(DOUT) LED40.4(DIN)
N$137: LED38.2(DOUT) LED39.4(DIN)
N$138: LED36.2(DOUT) LED37.4(DIN)
N$141: LED41.2(DOUT) LED42.4(DIN)
N$144: LED43.2(DOUT) LED44.4(DIN)
N$145: LED42.2(DOUT) LED43.4(DIN)
N$148: LED45.2(DOUT) LED46.4(DIN)
N$151: LED47.2(DOUT) LED48.4(DIN)
N$152: LED46.2(DOUT) LED47.4(DIN)
N$153: LED44.2(DOUT) LED45.4(DIN)
N$154: LED32.2(DOUT) LED33.4(DIN)
N$157: LED49.2(DOUT) LED50.4(DIN)
N$160: LED51.2(DOUT) LED52.4(DIN)
N$161: LED50.2(DOUT) LED51.4(DIN)
N$164: LED53.2(DOUT) LED54.4(DIN)
N$165: LED48.2(DOUT) LED49.4(DIN)
N$170: LED52.2(DOUT) LED53.4(DIN)
RGB_5V: LED1.4(DIN) ; also sheet 1
Unconnected: LED54.2(DOUT)

## Library data of the parts
BOOT RESET = Switch:SPST-NO_SWITCH: SPST Switches with NO Configuration; CATEGORY: Switches; DATASHEET: https://www.ckswitches.com/media/1479/kmr2.pdf; DESCRIPTION: Tactile Switch SPST-NO Top Actuated Surface Mount; MANUFACTURER: C&K; MPN: KMR211G LFS; OPERATING_TEMPERATURE: -40°C ~ 85°C; PACKAGE_SIZE: NA; PACKAGE_TYPE: Surface Mount; PART_STATUS: Active; ROHS: Compliant; SERIES: KMR2; SUBCATEGORY: Tactile Switches; TYPE: SPST-NO
C1 C2 C71 C72 = Capacitor:C-US: Capacitor - ANSI; CATEGORY: Capacitor; PACKAGE_SIZE: 1206; PACKAGE_TYPE: Surface Mount; SUBCATEGORY: Ceramic Capacitors; TYPE: MLCC
C3-C70 C73 C74 = Capacitor:C-US: Capacitor - ANSI; CATEGORY: Capacitor; PACKAGE_SIZE: 0805; PACKAGE_TYPE: Surface Mount; SUBCATEGORY: Ceramic Capacitors; TYPE: MLCC
D1-D55 = 1N4148W:1N4148W: 1N4148W Series 2 A 100 V 400 mW Surface Mount Fast Switching Diode - SOD-123 Check availability <https://pricing.snapeda.com/parts/1N4148W-7-F/Diodes%20Inc./view-part?ref=eda>; AVAILABILITY: In Stock; CHECK_PRICES: https://www.snapeda.com/parts/1N4148W-7-F/Diodes+Inc./view-part/?ref=eda; DESCRIPTION: Diode Switching 150mA 100V 400mW SOD123 | Diodes Inc 1N4148W-7-F; MF: Diodes Inc.; MP: 1N4148W-7-F; PACKAGE: SOD-123 Fairchild Semiconductor; PRICE: None; PURCHASE-URL: https://pricing.snapeda.com/search?q=1N4148W-7-F&ref=eda; SNAPEDA_LINK: https://www.snapeda.com/parts/1N4148W-7-F/Diodes+Inc./view-part/?ref=snap
D58 D59 = LED:CHIP-FLAT-G: Green LED - Generic; CATEGORY: LED; COLOR: Green; DESCRIPTION: Green LED Indication 1206 (3216 Metric); PACKAGE_SIZE: 1206; PACKAGE_TYPE: Surface Mount; SUBCATEGORY: Chip LED; TYPE: Square with Flat Top
J1 J2 = M55-6001242R:M55-6001242R; MANUFACTURER: Harwin; MAXIMUM_PACKAGE_HEIGHT: 7.5mm; PARTREV: 8; STANDARD: Manufacturer Recommendations
J3 = 1_1775333_6:1-1775333-6; COPYRIGHT: Copyright (C) 2025 Ultra Librarian. All rights reserved.; DATASHEET: https://www.te.com/commerce/DocumentDelivery/DDEController?Action=srchrtrv&DocNm=108-57590&DocType=Specification+Or+Standard&DocLang=English&PartCntxt=5-1775333-4&DocFormat=tif; DESCRIPTION: ZIF FPC 0.5, 2H, 16P; MANUFACTURER_NAME: TE Connectivity; MANUFACTURER_PART_NUMBER: 1-1775333-6; TYPE: Receptacle
J4 = F31L-1A7H1-11012:F31L-1A7H1-11012; MANUFACTURER: Amphenol ICC; MAXIMUM_PACKAGE_HEIGHT: 2.55mm; PARTREV: I; STANDARD: Manufacturer recommendations
JP1-JP3 = SparkFun-Jumpers:JUMPER-SMT_2_NC_TRACE: Normally closed trace jumper This jumper has a trace between two pads so it's normally closed (NC). Use a razor knife to open the connection. For best results follow the IPC guidelines for cutting traces: Cutout at least 0.063 mm (0.005 in). Remove all loose material to clean up the cut area. Seal the cut with an approved epoxy. Reapply solder to reclose the connection.
LED1-LED54 = SK6812-E:SK6812-E: Check availability <https://pricing.snapeda.com/parts/SK6812-E/DONGGUANG%20OPSCO%20OPTOELECTRONICS%20CO.%2C%20LTD/view-part?ref=eda>; AVAILABILITY: Not in stock; CHECK_PRICES: https://www.snapeda.com/parts/SK6812-E/DONGGUANG+OPSCO+OPTOELECTRONICS+CO.%252C+LTD/view-part/?ref=eda; DESCRIPTION: SK6812MINI-E is a smart LED control circuit and light emitting circuit in one controlled LED source, which has the shape of a 3528 LED chip.; MF: DONGGUANG OPSCO OPTOELECTRONICS CO., LTD; MP: SK6812-E; PACKAGE: Package; PRICE: None; SNAPEDA_LINK: https://www.snapeda.com/parts/SK6812-E/DONGGUANG+OPSCO+OPTOELECTRONICS+CO.%252C+LTD/view-part/?ref=snap
LS1 LS2 = CMS-151135-18S-X8:CMS-151135-18S-X8; MANUFACTURER: CUI Devices; MAXIMUM_PACKAGE_HEIGHT: 3.2mm; PARTREV: 1.0; STANDARD: Manufacturer Recommendations
R1-R15 = Resistor:R-US: Resistor Fixed - ANSI; CATEGORY: Resistors; DESCRIPTION: Chip Resistor 2.00 X 1.25 X 0.65 mm body 0805(2012-METRIC) Package; PACKAGE_SIZE: 0805; PACKAGE_TYPE: Surface Mount
S1-S54 = 5114:5114: Check availability <https://pricing.snapeda.com/parts/5114/Adafruit%20Industries%20LLC/view-part?ref=eda>; AVAILABILITY: In Stock; CHECK_PRICES: https://www.snapeda.com/parts/5114/Adafruit+Industries/view-part/?ref=eda; DESCRIPTION: Pushbutton Switch SPST-NO Keyswitch Through Hole; MF: Adafruit Industries LLC; MP: 5114; PACKAGE: None; PRICE: None; SNAPEDA_LINK: https://www.snapeda.com/parts/5114/Adafruit+Industries/view-part/?ref=snap
S55-S60 = SLW-1277744-3A-N-D:SLW-1277744-3A-N-D; MANUFACTURER: Same Sky; MAXIMUM_PACKAGE_HEIGHT: 8.0mm; PARTREV: 1.01; STANDARD: Manufacturer Recommendations
S61 = Switch:SPST-NO_SWITCH: SPST Switches with NO Configuration; CATEGORY: Switches; DATASHEET: https://www.ckswitches.com/media/1471/pts645.pdf; DESCRIPTION: Tactile Switch SPST-NO Top Actuated Surface Mount; MANUFACTURER: C&K; MPN: PTS645SM43SMTR92 LFS; OPERATING_TEMPERATURE: -20°C ~ 85°C; PACKAGE_SIZE: 6mm; PACKAGE_TYPE: Surface Mount; PART_STATUS: Active; ROHS: Compliant; SERIES: PTS645; SUBCATEGORY: Tactile Switches; TYPE: SPST-NO
TP1-TP13 = testpad:TP: Test pad
U1 = SC0914_13_:SC0914(13); MANUFACTURER: Raspberry Pi; MAXIMUM_PACKAGE_HEIGHT: 0.90 mm; PARTREV: 2.2; STANDARD: IPC 7351B
U2 = 2025-06-23_23-29-35_Library:AP2112K-3.3TRG1; COPYRIGHT: Copyright (C) 2025 Ultra Librarian. All rights reserved.; MANUFACTURER_PART_NUMBER: AP2112K-3.3TRG1; MFR_NAME: Diodes Inc
U3 = W25Q128JVSIM_TR:W25Q128JVSIM_TR: Check availability <https://pricing.snapeda.com/parts/W25Q128JVSIM%20TR/Winbond%20Electronics/view-part?ref=eda>; AVAILABILITY: In Stock; CHECK_PRICES: https://www.snapeda.com/parts/W25Q128JVSIM%20TR/Winbond/view-part/?ref=eda; DESCRIPTION: FLASH - NOR Memory IC 128Mb (16M x 8) SPI - Quad I/O, QPI, DTR 133 MHz 8-SOIC; MF: Winbond Electronics; MP: W25Q128JVSIM TR; PACKAGE: SOIC-8 Winbond Electronics; PRICE: None; SNAPEDA_LINK: https://www.snapeda.com/parts/W25Q128JVSIM%20TR/Winbond/view-part/?ref=snap
U4 U5 = SN74AHCT1G125DBVR:SN74AHCT1G125DBVR
U$1 = PEC09:PEC09-2120F-S0012
Y1 = ABM8-272-T3:ABM8-272-T3; CREATOR: DIZAR; MANUFACTURER: ABRACON; MAXIMUM_PACKAGE_HEIGHT: 0.8mm; PARTREV: 07-29-20; STANDARD: Manufacturer Recommendations